# Altium schematic sheet GD_Tcontroller_PWM.SchDoc
size A4
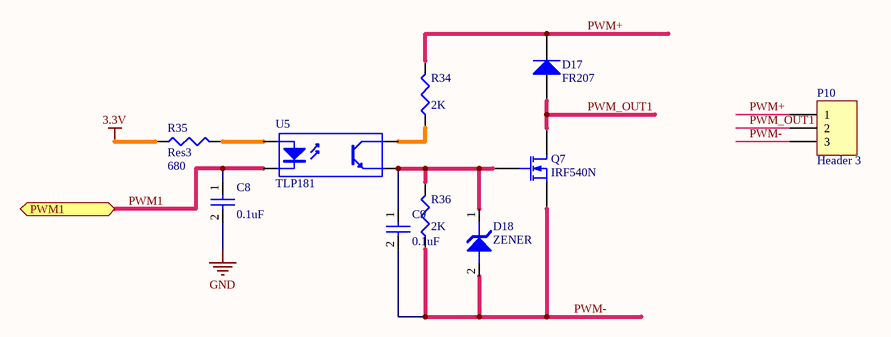
[diagram p0: GD_Tcontroller_PWM.SchDoc]

## Parts
C8  value 0.1uF  [C0805]  (hidden comment: CAP)
C9  value 0.1uF  [C0805]  (hidden comment: CAP)
D17  FR207  [ONSC-AXIAL_LEAD-2-59AA-01_P]
D18  ZENER  [SMB]
P10  Header 3  [HT5.08-3P-H]
Q7  IRF540N  [ONSC-TO-220-3-221A-09_AF]
R34  value 2K  [R1206]  (hidden comment: Res3)
R35  Res3  value 680  [R1206]
R36  value 2K  [R1206]  (hidden comment: Res3)
U5  TLP181  [TLP181]

## Ports
PWM1

## Nets
3.3V: R35.1
GND: C8.2
PWM1: C8.1 U5.2(K) ; port PWM1
PWM+: D17.2(K) P10.1 R34.2
PWM-: C9.2 D18.2 P10.3 Q7.3(S) R36.1
PWM_OUT1: D17.1(A) P10.2 Q7.1(D)
NetC9_1: C9.1 D18.1 Q7.2(G) R36.2 U5.3(E)
NetR34_1: R34.1 U5.4(C)
NetR35_2: R35.2 U5.1(A)

## Library data of the parts
C8 C9 = EC00014: CAP SMD CR X7R 50V 10% 0.1uF 0805 ROHS; Manufacturer: YAGEO; Manufacturer P/N: CC0805KRX7R9BB104; ID: 14; HelpURL: *; P/N: EC00014
D17 = Diode: Default Diode; Published: 8-Jun-2000; LatestRevisionDate: 17-Jul-2002; LatestRevisionNote: Re-released for DXP Platform.; PackageVersion: Sep-1996; PackageReference: SMC; Publisher: Altium Limited; PackageDescription: DO-214-AB/SMC; 2 C-Bend Leads; Body 7.9 x 5.9 mm, inc. leads (LxW); Code_JEDEC: DO-214-AB
D18 = ED00032: Manufacturer P/N: SMBJ15A; Manufacturer: Bourns; P/N: EE00002; Value: SMBJ15A; Type: ****
P10 = Header 3: Header, 3-Pin; LatestRevisionDate: 17-Jul-2002; LatestRevisionNote: Re-released for DXP Platform.; Publisher: Altium Limited
Q7 = MOSFET-N: N-Channel MOSFET; Published: 8-Jun-2000; LatestRevisionDate: 17-Jul-2002; LatestRevisionNote: Re-released for DXP Platform.; PackageVersion: 1995/1996; PackageReference: E3; Publisher: Altium Limited; PackageDescription: TO, Flat Index; 3 In-Line, Axial Leads; Body Dia. 4.6mm; Lead Dia. 0.5 mm (max)
R34-R36 = Res3: Resistor; Published: 8-Jun-2000; LatestRevisionDate: 29-May-2009; LatestRevisionNote: IPC-7351 Footprint Added.; PackageReference: J1-0603; Publisher: Altium Limited; PackageDescription: Chip Resistor
U5 = Optoisolator1: 4-Pin Phototransistor Optocoupler; Published: 24-Mar-1999; LatestRevisionDate: 04-Mar-2005; LatestRevisionNote: Sch pins 3 & 4 Swapped.; DatasheetVersion: Nov-2003; PackageReference: DIP-4; Publisher: Altium Limited